# EAGLE design v1 (EAGLE 9.6.2)
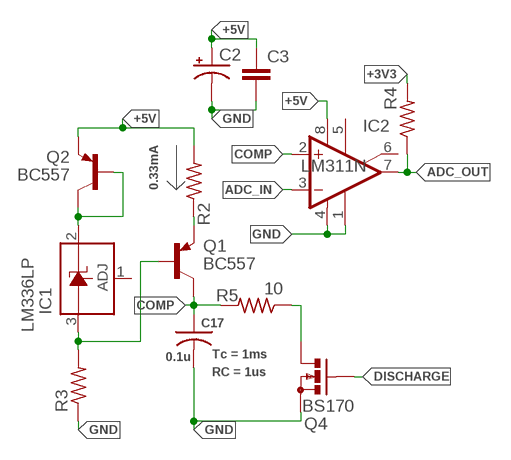
[diagram p0: schematic, sheet 1]

## Parts
C2  CPOL-USE2.5-5  [E2,5-5]
C3  C-EU025-024X044  [C025-024X044]
C17  0.1u  CAP0603  [C0603]
IC1  LM336LP  [TO92]
IC2  LM311N  [DIL08]
Q1  BC557  PNP_BC557*TO92  [TO92]
Q2  BC557  PNP_BC557*TO92  [TO92]
Q4  BS170  [SOT54E]
R2  R-US_0204/7  [0204/7]
R3  R-US_0204/7  [0204/7]
R4  R-US_0204/7  [0204/7]
R5  10  RESISTOR0207/7  [0207/7]

## Nets
+3V3: R4.2
+5V: C2.+ C3.1 IC2.8(V+) Q2.3(E) R2.2
ADC_IN: IC2.3(-IN)
ADC_OUT: IC2.7(OUT) R4.1
COMP: C17.1 IC2.2(+IN) Q1.1(C) R5.2
DISCHARGE: Q4.G
GND: C2.- C3.2 C17.2 IC2.1(GND) IC2.4(V-) Q4.S R3.1
N$2: Q1.3(E) R2.1
N$3: IC1.2(C) Q2.1(C) Q2.2(B)
N$4: IC1.3(A) Q1.2(B) R3.2
N$5: Q4.D R5.1
Unconnected: IC1.1(ADJ) IC2.5(ON) IC2.6(ON/STR)

## Notes on the sheet
- 0.33mA
- Tc = 1ms
- RC = 1us

## Library data of the parts
C2 = rcl:CPOL-US: POLARIZED CAPACITOR, American symbol; SPICEPREFIX: C
C3 = rcl:C-EU: CAPACITOR, European symbol; SPICEPREFIX: C
C17 = CEDT_JANUARY_2015_v5:CAP
IC1 = linear:LM336: 2.5-V INTEGRATED REFERENCE CIRCUITS LM236 Source: http://focus.ti.com/lit/ds/symlink/lm336-2.5.pdf
IC2 = linear:LM311: COMPARATOR
Q1 Q2 = Transistor:PNP_: PNP - Popular parts; CATEGORY: Transistor; SUB-CATEGORY: BJT; TYPE: PNP
Q4 = transistor-small-signal:BS170: N-CHANNEL MOS FET
R2-R4 = rcl:R-US_: RESISTOR, American symbol; SPICEPREFIX: R
R5 = CEDT_JANUARY_2015_v5 (1):RESISTOR

## Net classes
0 default: width 0.406 mm, drill 0.7 mm, clearance 0.25 mm
1 POWER: width 0.61 mm, drill 0.7 mm, clearance 0.25 mm

## Board
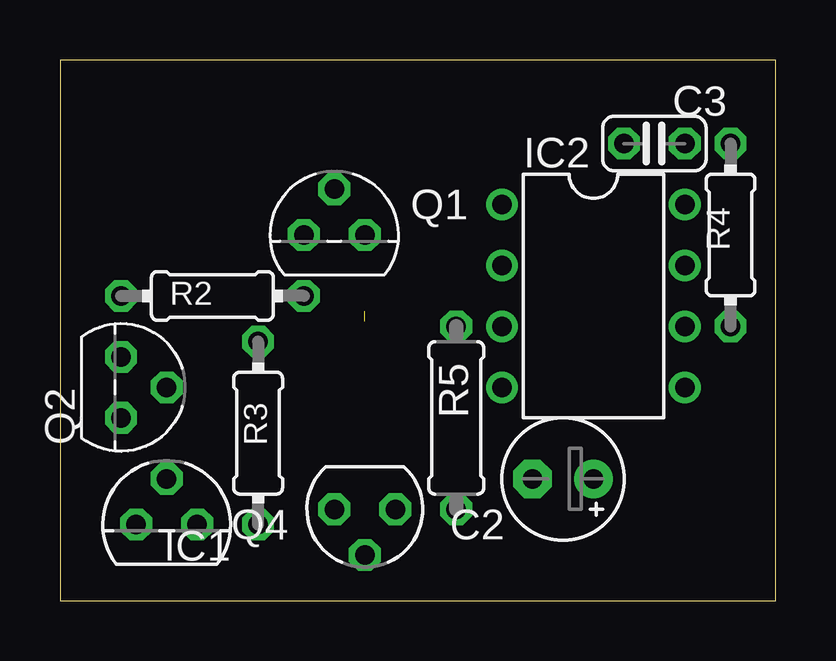
[diagram p1: board, top side]
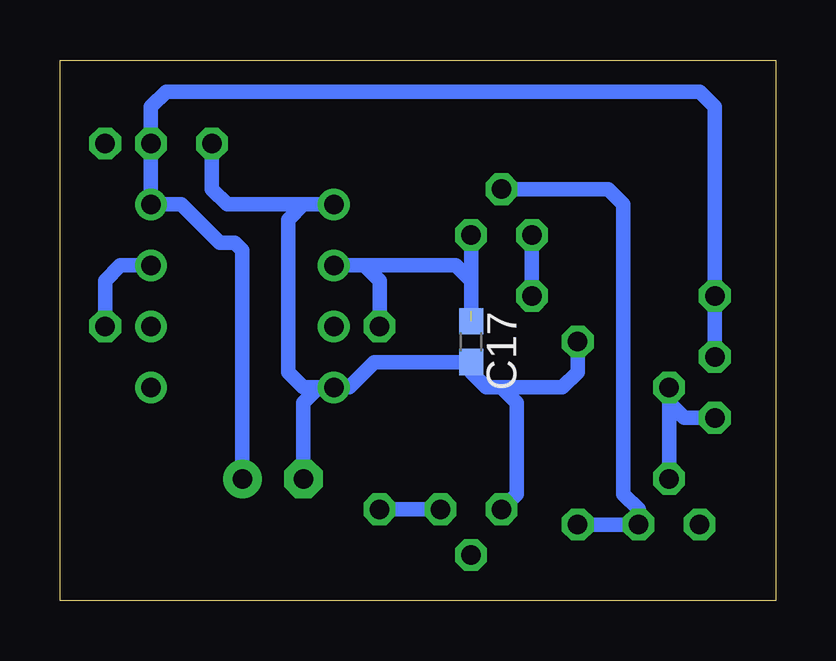
[diagram p2: board, bottom side, seen from below]

Size 29.82 x 22.53 mm. Coordinates in mm from the lower left corner, seen from the top.
Outline: 0,0 29.82,0 29.82,22.53 0,22.53 0,0
Copper layers (1*16): Top 0.035mm / dielectric 1.5mm / Bottom 0.035mm
Design rules "default": minimum track width 6mil, minimum drill 0.35mm, track to track 6mil, track to pad 6mil, pad to pad 6mil, via to via 6mil, smd to smd 6mil, copper to edge 40mil, drill to drill 6mil, minimum pad ring 10mil, minimum via ring 8mil, stop-mask expansion 4mil, vias tented up to drill 0mil, thermal gap 10mil

### Footprints (pad centres in the part's own frame; a part is rotated, then mirrored left to right if it is on the bottom)
E2,5-5 = drill 0.813 pad 1.6: + -1.27,0 | drill 0.813 pad 1.6 octagon: - 1.27,0
C025-024X044 = drill 0.813 octagon: 1 -1.27,0; 2 1.27,0
C0603 = smd 1.1 x 1: 1 -0.85,0; 2 0.85,0
TO92 = drill 0.813 octagon: 1 -1.27,0; 2 0,1.905; 3 1.27,0
DIL08 = drill 0.813 pad 1.27: 1 -3.81,-3.81; 2 -1.27,-3.81; 3 1.27,-3.81; 4 3.81,-3.81; 5 3.81,3.81; 6 1.27,3.81; 7 -1.27,3.81; 8 -3.81,3.81
TO92' = drill 0.813 octagon: 1 1.27,0; 2 0,1.905; 3 -1.27,0
SOT54E = drill 0.813 octagon: D -1.27,0; G 0,1.905; S 1.27,0
0204/7 = drill 0.813 octagon: 1 -3.81,0; 2 3.81,0
0207/7 = drill 0.813 octagon: 1 -3.81,0; 2 3.81,0

### Placement (x,y rotation side)
C2  20.96,5.08 180 top
C3  24.77,19.05 180 top
C17  12.7,10.79 270 bottom
IC1  4.45,3.17 0 top
IC2  22.23,12.7 270 top
Q1  BC557  [TO92']  11.43,15.24 0 top
Q2  BC557  [TO92']  2.54,8.89 270 top
Q4  12.7,3.81 180 top
R2  6.35,12.7 180 top
R3  8.26,6.99 270 top
R4  27.94,15.24 90 top
R5  16.51,7.62 90 top

### Tracks (layer width: path | path; a pad name or v marks a point on that pad's centre or on a via)
+5V
  Bottom 0.61: Q2.3 R2.2 2.54,20.57 3.18,21.21 25.4,21.21 26.04,20.57 C3.1 IC2.8 24.77,16.51 23.18,14.92 22.54,14.92 22.23,14.61 C2.+
ADC_OUT
  Bottom 0.61: IC2.7 27.3,13.97 27.94,13.34 R4.1
COMP  (1 unrouted)
  Bottom 0.61: Q1.1 12.7,13.34 | 12.7,13.34 13.34,13.97 17.14,13.97 | 12.7,13.34 12.7,12.06 | IC2.2 17.14,13.97 | R5.2 16.51,13.34 17.14,13.97
GND
  Bottom 0.61: R3.1 8.26,9.53 8.89,8.89 11.43,8.89 | IC2.4 19.68,8.89 20.32,9.53 20.32,15.88 19.68,16.51 IC2.1 22.86,16.51 23.5,17.14 C3.2 | IC2.4 19.05,8.89 19.68,8.26 C2.- | IC2.4 17.78,8.89 16.73,9.95 C17.2 12.7,9.53 12.07,8.89 11.43,8.89 | 11.43,8.89 10.79,8.26 10.79,4.45 Q4.S
N$2
  Bottom 0.61: R2.1 Q1.3
N$3
  Bottom 0.61: Q2.1 3.81,7.62 4.45,8.26 Q2.2 IC1.2
N$4
  Bottom 0.61: Q1.2 6.99,17.14 6.35,16.51 6.35,4.45 5.71,3.81 IC1.3 R3.2
N$5
  Bottom 0.61: Q4.D R5.1